# Altium schematic sheet MCU.SchDoc
size A4
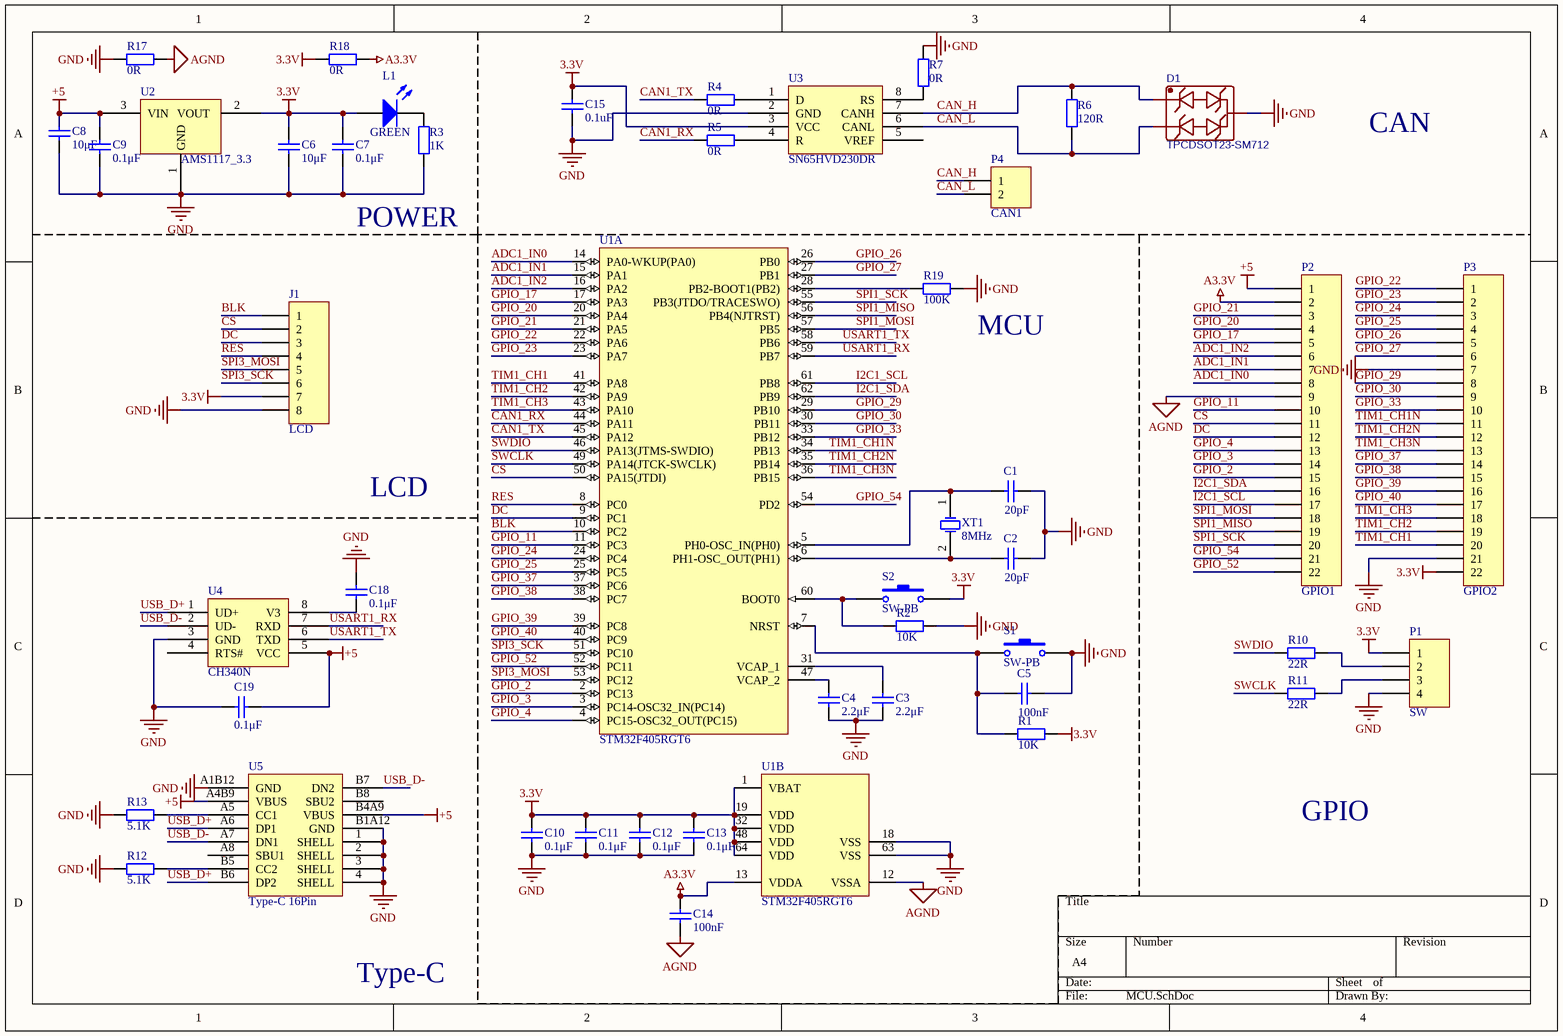
[diagram p0: MCU.SchDoc]

## Parts
C1  value 20pF  [0402]
C2  value 20pF  [0402]
C3  value 2.2μF  [0402]
C4  value 2.2μF  [0402]
C5  value 100nF  [0402]
C6  value 10μF  [0402]
C7  value 0.1μF  [0402]
C8  value 10μF  [0402]
C9  value 0.1μF  [0402]
C10  value 0.1μF  [0402]
C11  value 0.1μF  [0402]
C12  value 0.1μF  [0402]
C13  value 0.1μF  [0402]
C14  value 100nF  [0402]
C15  value 0.1uF  [0402]
C18  value 0.1μF  [0402]
C19  value 0.1μF  [0402]
D1  TPCDSOT23-SM712  [SOT23-3_L2.9-W1.6-P1.90-LS2.8-BR]
J1  LCD  [HDR1X8]
L1  GREEN  [0402-A]
P1  SW  [HDR1X4]
P2  GPIO1  [HDR1X22]
P3  GPIO2  [HDR1X22]
P4  CAN1  [FPC-SMD_2P-P2.00_DEALON_PH-2PWB]
R1  10K  [0402]
R2  10K  [0402]
R3  1K  [0402]
R4  0R  [0402]
R5  0R  [0402]
R6  120R  [0402]
R7  0R  [0402]
R10  22R  [0402]
R11  22R  [0402]
R12  5.1K  [0402]
R13  5.1K  [0402]
R17  0R  [0402]
R18  0R  [0402]
R19  100K  [0402]
S1  SW-PB  [KEY-SMD_4P-L4.2-W3.2-P2.20-LS5.1-TL]
S2  SW-PB  [KEY-SMD_4P-L4.2-W3.2-P2.20-LS5.1-TL]
U1  STM32F405RGT6  [STM-LQFP64_N]  (parts A,B of 2)
U2  AMS1117_3.3  [SOT-89-3_L4.5-W2.5-P1.50-LS4.1-BL]
U3  SN65HVD230DR  [SN65HVD230DR-SOIC-8_L4.9-W3.9-P1.27-LS6.0-BL]
U4  CH340N  [CH340N-SOP-8_L4.9-W3.9-P1.27-LS6.0-BL]
U5  Type-C 16Pin  [USB-C-SMD_TYPE-C16PIN]
XT1  8MHz  [OSC-SMD_L5.0-W3.2]

## Nets
3.3V: C6.2 C7.2 C10.2 C11.2 C12.2 C13.2 C15.2 J1.7 L1.1(A) P1.1 P3.22 R1.2 R18.1 S2.2 U1.1(VBAT) U1.19(VDD) U1.32(VDD) U1.48(VDD) U1.64(VDD) U2.2(VOUT) U3.3(VCC)
+5: C8.2 C9.2 C19.1 P2.1 U2.3(VIN) U4.5(VCC) U5.A4B9(VBUS) U5.B4A9(VBUS)
A3.3V: C14.2 P2.2 R18.2 U1.13(VDDA)
AGND: C14.1 P2.9 R17.2 U1.12(VSSA)
GND: C1.2 C2.2 C3.1 C4.1 C5.2 C6.1 C7.1 C8.1 C9.1 C10.1 C11.1 C12.1 C13.1 C15.1 C18.2 C19.2 D1.3 J1.8 P1.4 P3.7 P3.21 R2.2 R3.1 R7.2 R12.1 R13.1 R17.1 R19.2 S1.2 U1.18(VSS) U1.63(VSS) U2.1(GND) U3.2(GND) U4.3(GND) U5.1(SHELL) U5.2(SHELL) U5.3(SHELL) U5.4(SHELL) U5.A1B12(GND) U5.B1A12(GND)
ADC1_IN0: P2.8 U1.14(PA0-WKUP(PA0))
ADC1_IN1: P2.7 U1.15(PA1)
ADC1_IN2: P2.6 U1.16(PA2)
BLK: J1.1 U1.10(PC2)
CAN1_RX: R5.1 U1.44(PA11)
CAN1_TX: R4.1 U1.45(PA12)
CAN_H: D1.1 P4.1 R6.2 U3.7(CANH)
CAN_L: D1.2 P4.2 R6.1 U3.6(CANL)
CS: J1.2 P2.11 U1.50(PA15(JTDI))
DC: J1.3 P2.12 U1.9(PC1)
GPIO_2: P2.15 U1.2(PC13)
GPIO_3: P2.14 U1.3(PC14-OSC32_IN(PC14))
GPIO_4: P2.13 U1.4(PC15-OSC32_OUT(PC15))
GPIO_11: P2.10 U1.11(PC3)
GPIO_17: P2.5 U1.17(PA3)
GPIO_20: P2.4 U1.20(PA4)
GPIO_21: P2.3 U1.21(PA5)
GPIO_22: P3.1 U1.22(PA6)
GPIO_23: P3.2 U1.23(PA7)
GPIO_24: P3.3 U1.24(PC4)
GPIO_25: P3.4 U1.25(PC5)
GPIO_26: P3.5 U1.26(PB0)
GPIO_27: P3.6 U1.27(PB1)
GPIO_29: P3.8 U1.29(PB10)
GPIO_30: P3.9 U1.30(PB11)
GPIO_33: P3.10 U1.33(PB12)
GPIO_37: P3.14 U1.37(PC6)
GPIO_38: P3.15 U1.38(PC7)
GPIO_39: P3.16 U1.39(PC8)
GPIO_40: P3.17 U1.40(PC9)
GPIO_52: P2.22 U1.52(PC11)
GPIO_54: P2.21 U1.54(PD2)
I2C1_SCL: P2.17 U1.61(PB8)
I2C1_SDA: P2.16 U1.62(PB9)
RES: J1.4 U1.8(PC0)
SPI1_MISO: P2.19 U1.56(PB4(NJTRST))
SPI1_MOSI: P2.18 U1.57(PB5)
SPI1_SCK: P2.20 U1.55(PB3(JTDO/TRACESWO))
SPI3_MOSI: J1.5 U1.53(PC12)
SPI3_SCK: J1.6 U1.51(PC10)
SWCLK: R11.1 U1.49(PA14(JTCK-SWCLK))
SWDIO: R10.1 U1.46(PA13(JTMS-SWDIO))
TIM1_CH1: P3.20 U1.41(PA8)
TIM1_CH1N: P3.11 U1.34(PB13)
TIM1_CH2: P3.19 U1.42(PA9)
TIM1_CH2N: P3.12 U1.35(PB14)
TIM1_CH3: P3.18 U1.43(PA10)
TIM1_CH3N: P3.13 U1.36(PB15)
USART1_RX: U1.59(PB7) U4.7(RXD)
USART1_TX: U1.58(PB6) U4.6(TXD)
USB_D+: U4.1(UD+) U5.A6(DP1) U5.B6(DP2)
USB_D-: U4.2(UD-) U5.A7(DN1) U5.B7(DN2)
NetC1_1: C1.1 U1.5(PH0-OSC_IN(PH0)) XT1.1(OSC1)
NetC2_1: C2.1 U1.6(PH1-OSC_OUT(PH1)) XT1.2(OSC2)
NetC3_2: C3.2 U1.31(VCAP_1)
NetC4_2: C4.2 U1.47(VCAP_2)
NetC5_1: C5.1 R1.1 S1.1 U1.7(NRST)
NetC18_1: C18.1 U4.8(V3)
NetL1_2: L1.2(K) R3.2
NetP1_2: P1.2 R10.2
NetP1_3: P1.3 R11.2
NetR2_1: R2.1 S2.1 U1.60(BOOT0)
NetR4_2: R4.2 U3.1(D)
NetR5_2: R5.2 U3.4(R)
NetR7_1: R7.1 U3.8(RS)
NetR12_2: R12.2 U5.B5(CC2)
NetR13_2: R13.2 U5.A5(CC1)
NetR19_1: R19.1 U1.28(PB2-BOOT1(PB2))

Not connected (* = marked no-connect by the designer): U3 5(VREF); U4 4(RTS#); U5 A8(SBU1) B8(SBU2)

## Notes on the sheet
- CAN
- POWER
- (near R19) MCU
- LCD
- GPIO
- Type-C

## Library data of the parts
C1-C15 C18 C19 = Cap Semi: Capacitor (Semiconductor SIM Model); Published: 8-Jun-2000; LatestRevisionDate: 29-May-2009; LatestRevisionNote: IPC-7351 Footprint Added.; PackageReference: C1206; Publisher: Altium Limited; PackageDescription: Chip Capacitor
D1 = TPCDSOT23-SM712: BOM_Manufacturer: TECH PUBLIC; Contributor: LCSC; BOM_Supplier: LCSC; BOM_Supplier Part: C558433; BOM_Manufacturer Part: TPCDSOT23-SM712; BOM_JLCPCB Part Class: Extended Part; spicePre: D; spiceSymbolName: TPCDSOT23-SM712
J1 = Header 8: Header, 8-Pin; LatestRevisionDate: 17-Jul-2002; LatestRevisionNote: Re-released for DXP Platform.; Publisher: Altium Limited
L1 = LED2: Typical RED, GREEN, YELLOW, AMBER GaAs LED; Published: 8-Jun-2000; LatestRevisionDate: 17-Jul-2002; LatestRevisionNote: Re-released for DXP Platform.; PackageVersion: Feb-2002; PackageReference: 3.2X1.6X1.1; Publisher: Altium Limited; PackageDescription: SM LED; 2 Flat Leads
P1 = Header 4: Header, 4-Pin; LatestRevisionDate: 17-Jul-2002; LatestRevisionNote: Re-released for DXP Platform.; Publisher: Altium Limited
P2 P3 = Header 22: Header, 22-Pin; LatestRevisionDate: 17-Jul-2002; LatestRevisionNote: Re-released for DXP Platform.; Publisher: Altium Limited
P4 = Header 2: Header, 2-Pin; LatestRevisionDate: 17-Jul-2002; LatestRevisionNote: Re-released for DXP Platform.; Publisher: Altium Limited
R1-R7 R10-R13 R17-R19 = Res2: Resistor; Published: 8-Jun-2000; LatestRevisionDate: 17-Jul-2002; LatestRevisionNote: Re-released for DXP Platform.; PackageReference: AXIAL-0.4; Publisher: Altium Limited; PackageDescription: Axial Device, Thru-Hole; 2 Leads; 0.4 in Pin Spacing
S1 S2 = SW-PB: Switch; Published: 24-Mar-1999; LatestRevisionDate: 17-Jul-2002; LatestRevisionNote: Re-released for DXP Platform.; PackageReference: SPST-2; Publisher: Altium Limited; PackageDescription: Switch; 2 Leads
U1 = STM32F405RGT6: ARM Cortex-M4 32-bit MCU+FPU, 210 DMIPS, 1024 kB Flash, 192 kB Internal RAM, 51 I/Os, 64-pin LQFP, -40 to 85 degC, Tray; Manufacturer: STMicroelectronics; D/A Converter: 2x12-bit; FLASH Size (Prog) (kB): 1024; I/Os (High Current): 51; Internal RAM Size (kB): 192; Operating Frequency(F) (Processor speed) (MHz): 168; Supply Voltage(Vcc) max (V): 3.6; Supply Voltage(Vcc) min (V): 1.8; DatasheetVersion: Rev. 4; PackageVersion: Rev. 4, 06/2013; PackageReference: LQFP64; PackageDescription: 64-Pin Low Profile Quad Flat Package, 10 x 10 mm Body, 0.5 mm Pitch; Supplier 1: Digi-Key; Supplier Part Number 1: 497-11767-ND; Supplier 2: Farnell; Supplier Part Number 2: 2064363; Supplier 3: Newark; Supplier Part Number 3: 73T2329; Supplier 4: Mouser; Supplier Part Number 4: 511-STM32F405RGT6; Core: ARM Cortex-M4; Packing: Tray; Mounting Technology: Surface Mount; PartNumber: STM32F405RGT6; ComponentLink1Description: Manufacturer URL; ComponentLink1URL: http://www.st.com/web/en/home.html; ComponentLink2Description: Datasheet; ComponentLink2URL: http://www.st.com/st-web-ui/static/active/en/resource/technical/document/datasheet/DM00037051.pdf; ComponentLink3Description: Package Specification; ComponentLink3URL: http://www.st.com/st-web-ui/static/active/en/resource/technical/document/datasheet/DM00037051.pdf
U2 = AMS1117_3.3 SOT-89
XT1 = XTAL: Crystal Oscillator; Published: 8-Jun-2000; LatestRevisionDate: 17-Jul-2002; LatestRevisionNote: Re-released for DXP Platform.; PackageReference: R38; Publisher: Altium Limited; PackageDescription: Crystal, Thru-Hole; 2 Leads; Body 3.1 x 8.2 mm (Dia.xH)